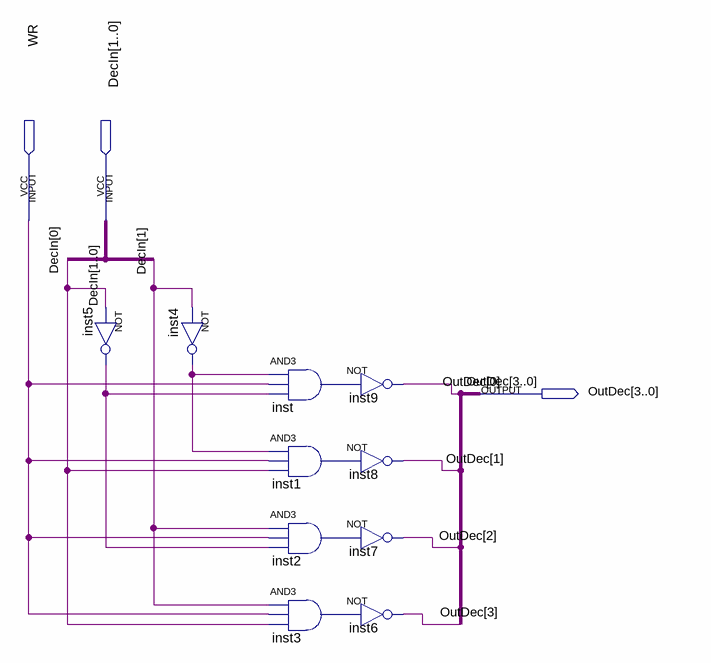
[diagram p0: schematic sheet]
// Quartus schematic 2to4.bdf as structural Verilog: 10 symbols, 3 pins
module \2to4  (
  input  WR,
  input  [1:0] DecIn,
  output [3:0] OutDec
);

  wire inst1_out, inst2_out, inst3_out, inst4_out, inst5_out, inst_out;

  not inst5 (inst5_out, DecIn[0]);
  not inst4 (inst4_out, DecIn[1]);
  and inst (inst_out, inst4_out, WR, inst5_out);
  and inst1 (inst1_out, inst4_out, WR, DecIn[0]);
  and inst2 (inst2_out, DecIn[1], WR, inst5_out);
  and inst3 (inst3_out, DecIn[1], WR, DecIn[0]);
  not inst9 (OutDec[0], inst_out);
  not inst8 (OutDec[1], inst1_out);
  not inst7 (OutDec[2], inst2_out);
  not inst6 (OutDec[3], inst3_out);
endmodule
